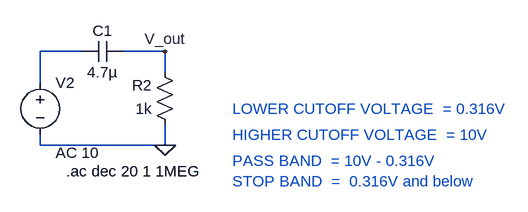
[diagram p0: schematic lab2_HPF_2019A3PS0443H_VISHWAS_GAUTAM.asc]
lab2_HPF_2019A3PS0443H_VISHWAS_GAUTAM.asc, the LTspice schematic file:
Version 4
SHEET 1 880 680
WIRE -528 -16 -592 -16
WIRE -400 -16 -464 -16
WIRE -400 16 -400 -16
WIRE -592 32 -592 -16
WIRE -592 128 -592 112
WIRE -400 128 -400 96
WIRE -400 128 -592 128
FLAG -400 128 0
FLAG -400 -16 V_out
SYMBOL voltage -592 16 R0
WINDOW 123 24 124 Left 2
WINDOW 39 0 0 Left 2
SYMATTR Value2 AC 10
SYMATTR InstName V2
SYMATTR Value ""
SYMBOL res -384 112 R180
WINDOW 0 36 76 Left 2
WINDOW 3 36 40 Left 2
SYMATTR InstName R2
SYMATTR Value 1k
SYMBOL cap -464 -32 R90
WINDOW 0 0 32 VBottom 2
WINDOW 3 32 32 VTop 2
SYMATTR InstName C1
SYMATTR Value 4.7µ
TEXT -552 168 Left 2 !.ac dec 20 1 1MEG
TEXT -296 72 Left 2 ;LOWER CUTOFF VOLTAGE  = 0.316V
TEXT -296 112 Left 2 ;HIGHER CUTOFF VOLTAGE  = 10V
TEXT -296 152 Left 2 ;PASS BAND  = 10V - 0.316V
TEXT -296 184 Left 2 ;STOP BAND  =  0.316V and below

The netlist it stands for:
* lab2_HPF_2019A3PS0443H_VISHWAS_GAUTAM.asc
V2 N001 0 AC 10
R2 0 V_out 1k
C1 V_out N001 4.7µ
.ac dec 20 1 1MEG
* LOWER CUTOFF VOLTAGE  = 0.316V
* HIGHER CUTOFF VOLTAGE  = 10V
* PASS BAND  = 10V - 0.316V
* STOP BAND  =  0.316V and below
.backanno
.end